# EAGLE design RPiAutonomousCar (EAGLE 7.5.0)
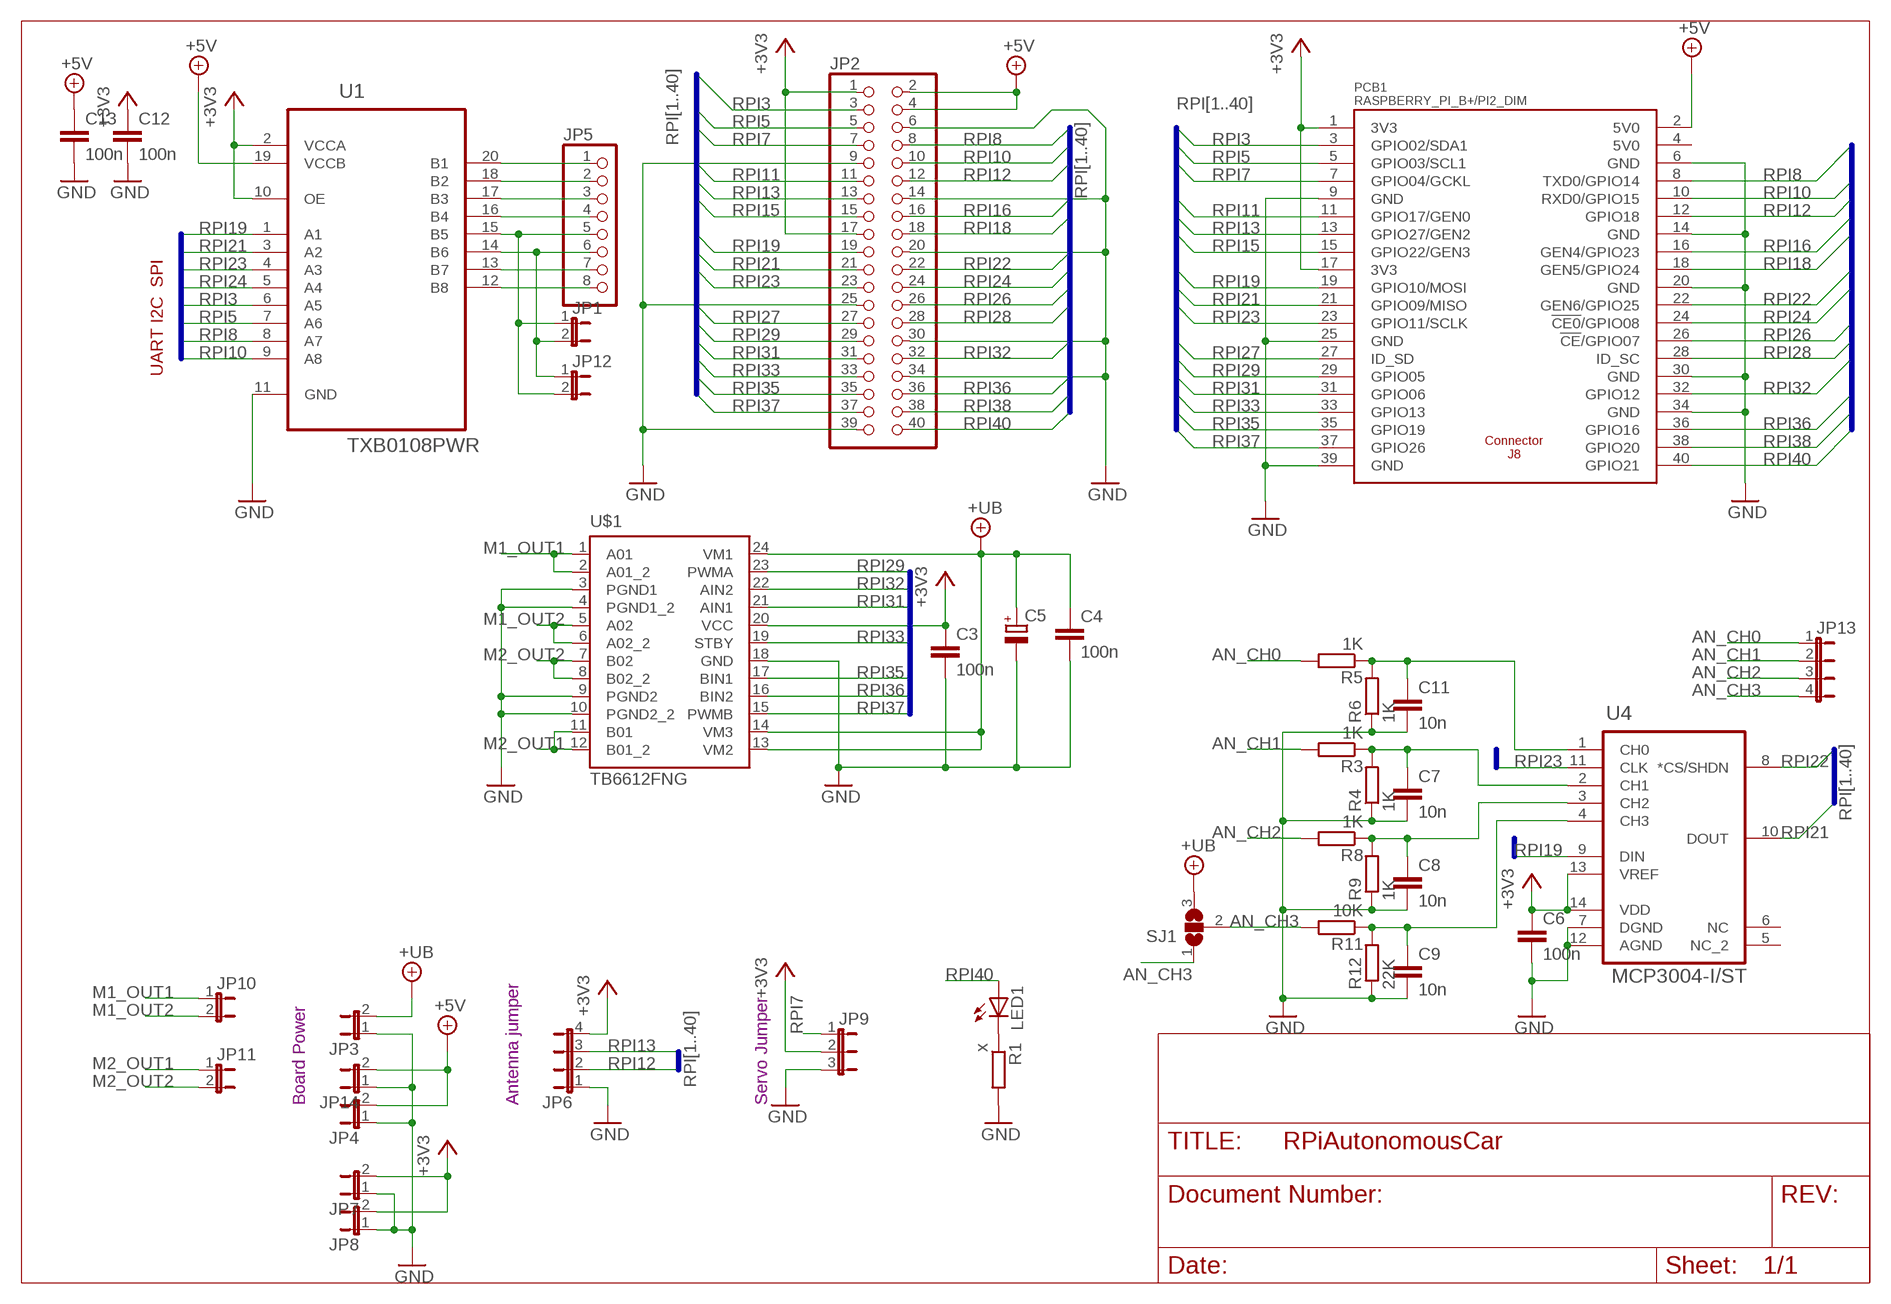
[diagram p0: schematic, sheet 1]

## Parts
C3  100n  C-EUC0603  [C0603]
C4  100n  C-EUC0603  [C0603]
C5  CPOL-EU153CLV-0405  [153CLV-0405]
C6  100n  C-EUC0603  [C0603]
C7  10n  C-EUC0603  [C0603]
C8  10n  C-EUC0603  [C0603]
C9  10n  C-EUC0603  [C0603]
C11  10n  C-EUC0603  [C0603]
C12  100n  C-EUC0603  [C0603]
C13  100n  C-EUC0603  [C0603]
JP1  JP1E  [JP1]
JP2  PINHD-2X20  [2X20]
JP3  JP1E  [JP1]
JP4  JP1E  [JP1]
JP5  PINHD-1X8  [1X08]
JP6  JP4E  [JP4]
JP7  JP1E  [JP1]
JP8  JP1E  [JP1]
JP9  JP2E  [JP2]
JP10  JP1E  [JP1]
JP11  JP1E  [JP1]
JP12  JP1E  [JP1]
JP13  JP4E  [JP4]
JP14  JP1E  [JP1]
LED1  LEDSML0603  [SML0603]
PCB1  RASPBERRY_PI_B+/PI2_DIM  [RASPBERRY_PI_BPLUS_HEADER_ONLY]
R1  x  R-EU_R0603  [R0603]
R3  1K  R-EU_R0603  [R0603]
R4  1K  R-EU_R0603  [R0603]
R5  1K  R-EU_R0603  [R0603]
R6  1K  R-EU_R0603  [R0603]
R8  1K  R-EU_R0603  [R0603]
R9  1K  R-EU_R0603  [R0603]
R11  10K  R-EU_R0603  [R0603]
R12  22K  R-EU_R0603  [R0603]
SJ1  SJ2W  [SJ_2]
U1  TXB0108PWR  [SOP65P640X120-20N]
U4  MCP3004-I/ST  [SOP65P640X120-14N]
U$1  TB6612FNG  [SSOP24]

## Nets
+3V3: C3.1 C6.1 C12.1 JP2.1 JP2.17 JP6.4 JP7.2 JP8.2 JP9.2 PCB1.1(3V3) PCB1.17(3V3) U1.2(VCCA) U1.10(OE) U4.13(VREF) U4.14(VDD) U$1.20(VCC)
+5V: C13.1 JP2.2 JP2.4 JP4.2 JP14.2 PCB1.2(5V0) U1.19(VCCB)
+UB: C4.1 C5.+ JP3.2 SJ1.3 U$1.13(VM2) U$1.14(VM3) U$1.24(VM1)
AN_CH0: JP13.1 R5.2
AN_CH1: JP13.2 R3.2
AN_CH2: JP13.3 R8.2
AN_CH3: JP13.4 R11.2 SJ1.1 SJ1.2
GND: C3.2 C4.2 C5.- C6.2 C7.2 C8.2 C9.2 C11.2 C12.2 C13.2 JP2.6 JP2.9 JP2.14 JP2.20 JP2.25 JP2.30 JP2.34 JP2.39 JP3.1 JP4.1 JP6.1 JP7.1 JP8.1 JP9.3 JP14.1 PCB1.6(GND) PCB1.9(GND) PCB1.14(GND) PCB1.20(GND) PCB1.25(GND) PCB1.30(GND) PCB1.34(GND) PCB1.39(GND) R1.2 R4.1 R6.1 R9.1 R12.1 U1.11(GND) U4.7(DGND) U4.12(AGND) U$1.3(PGND1) U$1.4(PGND1_2) U$1.9(PGND2) U$1.10(PGND2_2) U$1.18(GND)
M1_OUT1: JP10.1 U$1.1(A01) U$1.2(A01_2)
M1_OUT2: JP10.2 U$1.5(A02) U$1.6(A02_2)
M2_OUT1: JP11.1 U$1.11(B01) U$1.12(B01_2)
M2_OUT2: JP11.2 U$1.7(B02) U$1.8(B02_2)
N$1: JP5.8 U1.12(B8)
N$2: JP5.7 U1.13(B7)
N$4: JP1.2 JP5.6 JP12.1 U1.14(B6)
N$5: JP5.4 U1.16(B4)
N$6: JP5.3 U1.17(B3)
N$7: JP5.2 U1.18(B2)
N$8: JP5.1 U1.20(B1)
N$11: C11.1 R5.1 R6.2 U4.1(CH0)
N$12: LED1.C R1.1
N$13: C7.1 R3.1 R4.2 U4.2(CH1)
N$14: C8.1 R8.1 R9.2 U4.3(CH2)
N$15: C9.1 R11.1 R12.2 U4.4(CH3)
N$18: JP1.1 JP5.5 JP12.2 U1.15(B5)
RPI3: JP2.3 PCB1.3(GPIO02/SDA1) U1.6(A5)
RPI5: JP2.5 PCB1.5(GPIO03/SCL1) U1.7(A6)
RPI7: JP2.7 JP9.1 PCB1.7(GPIO04/GCKL)
RPI8: JP2.8 PCB1.8(TXD0/GPIO14) U1.8(A7)
RPI10: JP2.10 PCB1.10(RXD0/GPIO15) U1.9(A8)
RPI11: JP2.11 PCB1.11(GPIO17/GEN0)
RPI12: JP2.12 JP6.2 PCB1.12(GPIO18)
RPI13: JP2.13 JP6.3 PCB1.13(GPIO27/GEN2)
RPI15: JP2.15 PCB1.15(GPIO22/GEN3)
RPI16: JP2.16 PCB1.16(GEN4/GPIO23)
RPI18: JP2.18 PCB1.18(GEN5/GPIO24)
RPI19: JP2.19 PCB1.19(GPIO10/MOSI) U1.1(A1) U4.9(DIN)
RPI21: JP2.21 PCB1.21(GPIO09/MISO) U1.3(A2) U4.10(DOUT)
RPI22: JP2.22 PCB1.22(GEN6/GPIO25) U4.8(*CS/SHDN)
RPI23: JP2.23 PCB1.23(GPIO11/SCLK) U1.4(A3) U4.11(CLK)
RPI24: JP2.24 PCB1.24(!CE0!/GPIO08) U1.5(A4)
RPI26: JP2.26 PCB1.26(!CE!/GPIO07)
RPI27: JP2.27 PCB1.27(ID_SD)
RPI28: JP2.28 PCB1.28(ID_SC)
RPI29: JP2.29 PCB1.29(GPIO05) U$1.23(PWMA)
RPI31: JP2.31 PCB1.31(GPIO06) U$1.21(AIN1)
RPI32: JP2.32 PCB1.32(GPIO12) U$1.22(AIN2)
RPI33: JP2.33 PCB1.33(GPIO13) U$1.19(STBY)
RPI35: JP2.35 PCB1.35(GPIO19) U$1.17(BIN1)
RPI36: JP2.36 PCB1.36(GPIO16) U$1.16(BIN2)
RPI37: JP2.37 PCB1.37(GPIO26) U$1.15(PWMB)
RPI38: JP2.38 PCB1.38(GPIO20)
RPI40: JP2.40 LED1.A PCB1.40(GPIO21)
Unconnected: U4.5(NC_2) U4.6(NC)

## Buses
RPI[1..40]

## Notes on the sheet
- SPI
- I2C
- UART
- Board Power | Antenna jumper | Servo Jumper

## Power pins joined to a net without a drawn wire
5V0: PCB1.4(5V0)

## Library data of the parts
C3 C4 C6-C9 C11-C13 = rcl:C-EU: CAPACITOR, European symbol
C5 = rcl:CPOL-EU: POLARIZED CAPACITOR, European symbol
JP1 JP3 JP4 JP7 JP8 JP10-JP12 JP14 = jumper:JP1E: JUMPER
JP2 = pinhead:PINHD-2X20: PIN HEADER
JP5 = pinhead:PINHD-1X8: PIN HEADER
JP6 JP13 = jumper:JP4E: JUMPER
JP9 = jumper:JP2E: JUMPER
LED1 = led:LED: LED OSRAM: - CHIPLED LG R971, LG N971, LY N971, LG Q971, LY Q971, LO R971, LY R971 LH N974, LH R974 LS Q976, LO Q976, LY Q976 LO Q996 - Hyper CHIPLED LW Q18S LB Q993, LB Q99A, LB R99A - SideLED LS A670, LO A670, LY A670, LG A670, LP A670 LB A673, LV A673, LT A673, LW A673 LH A674 LY A675 LS A676, LA A676, LO A676, LY A676, LW A676 LS A679, LY A679, LG A679 - Hyper Micro SIDELED® LS Y876, LA Y876, LO Y876, LY Y876 LT Y87S - SmartLED LW L88C, LW L88S LB L89C, LB L89S, LG L890 LS L89K, LO L89K, LY L89K LS L896, LA L896, LO L896, LY L896 - TOPLED LS T670, LO T670, LY T670, LG T670, LP T670 LSG T670, LSP T670, LSY T670, LOP T670, LYG T670 LG T671, LOG T671, LSG T671 LB T673, LV T673, LT T673, LW T673 LH T674 LS T676, LA T676, LO T676, LY T676, LB T676, LH T676, LSB T676, LW T676 LB T67C, LV T67C, LT T67C, LS T67K, LO T67K, LY T67K, LW E67C LS E67B, LA E67B, LO E67B, LY E67B, LB E67C, LV E67C, LT E67C LW T67C LS T679, LY T679, LG T679 LS T770, LO T770, LY T770, LG T770, LP T770 LB T773, LV T773, LT T773, LW T773 LH T774 LS E675, LA E675, LY E675, LS T675 LS T776, LA T776, LO T776, LY T776, LB T776 LHGB T686 LT T68C, LB T68C - Hyper Mini TOPLED® LB M676 - Mini TOPLED Santana® LG M470 LS M47K, LO M47K, LY M47K Source: http://www.osram.convergy.de LUXEON: - LUMILED® LXK2-PW12-R00, LXK2-PW12-S00, LXK2-PW14-U00, LXK2-PW14-V00 LXK2-PM12-R00, LXK2-PM12-S00, LXK2-PM14-U00 LXK2-PE12-Q00, LXK2-PE12-R00, LXK2-PE12-S00, LXK2-PE14-T00, LXK2-PE14-U00 LXK2-PB12-K00, LXK2-PB12-L00, LXK2-PB12-M00, LXK2-PB14-N00, LXK2-PB14-P00, LXK2-PB14-Q00 LXK2-PR12-L00, LXK2-PR12-M00, LXK2-PR14-Q00, LXK2-PR14-R00 LXK2-PD12-Q00, LXK2-PD12-R00, LXK2-PD12-S00 LXK2-PH12-R00, LXK2-PH12-S00 LXK2-PL12-P00, LXK2-PL12-Q00, LXK2-PL12-R00 Source: www.luxeon.com KINGBRIGHT: KA-3528ASYC Source: www.kingbright.com
PCB1 = RPiAutonomousCar:RASPBERRY_PI_B+/PI2: Raspberry Pi B+ Basedon issue: Thursday, July 10, 2014 - Rev 1.2 LBR by Tim Rettmann 07-2014
R1 R3-R6 R8 R9 R11 R12 = rcl:R-EU_: RESISTOR, European symbol
SJ1 = jumper:SJ2W: SMD solder JUMPER
U1 = RPiAutonomousCar:TXB0108PWR: 8-BIT BIDIRECTIONAL VOLTAGE-LEVEL TRANSLATOR; MPN: TXB0108PWR; OC_FARNELL: 1494945; OC_NEWARK: 27M1151; PACKAGE: TSSOP-20; SUPPLIER: Texas Instruments
U4 = RPiAutonomousCar:MCP3004-I/ST: IC, 10BIT ADC 4-CH, SMD; MPN: MCP3004-I/ST; OC_FARNELL: 1523365; OC_NEWARK: 74M3032; PACKAGE: 14TSSOP; SUPPLIER: Microchip
U$1 = RPiAutonomousCar:TB6612FNG

## Net classes
1 vcc: width 0.203 mm

## Board
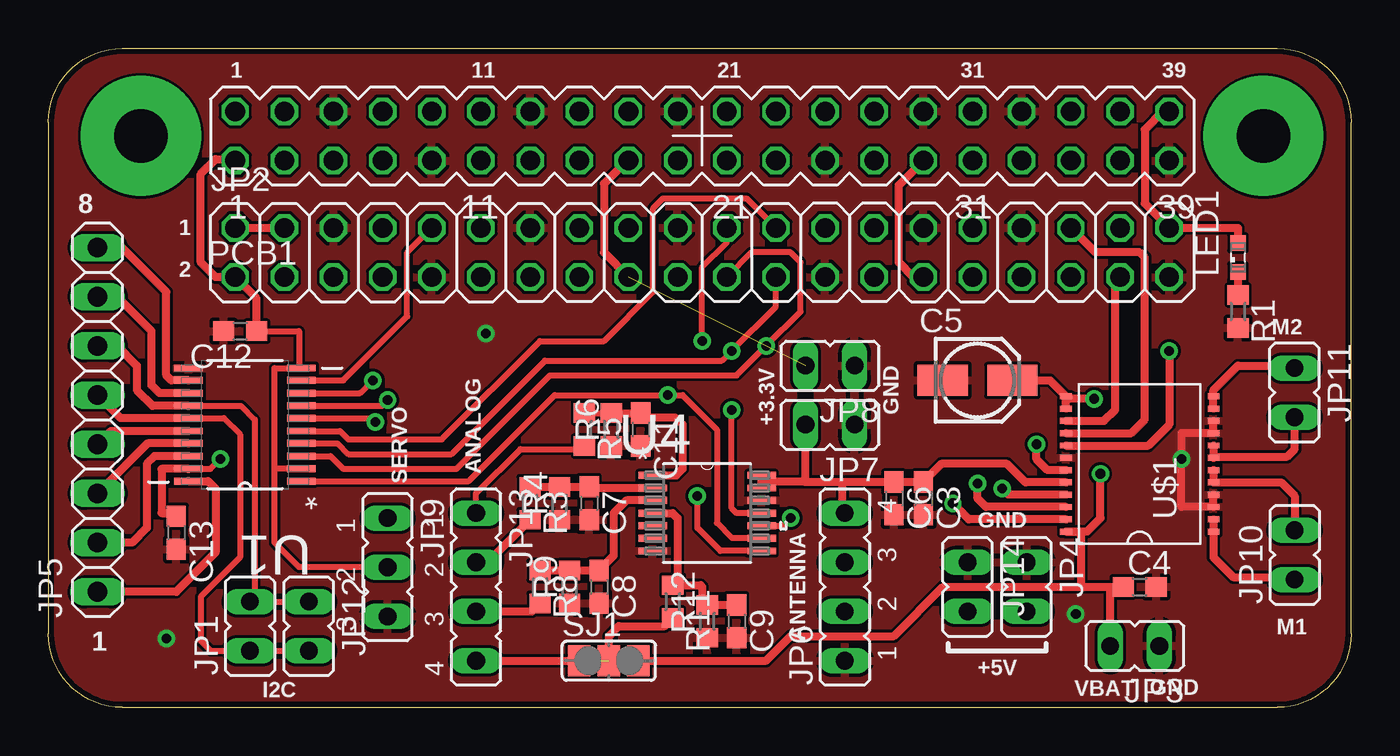
[diagram p1: board, top side]
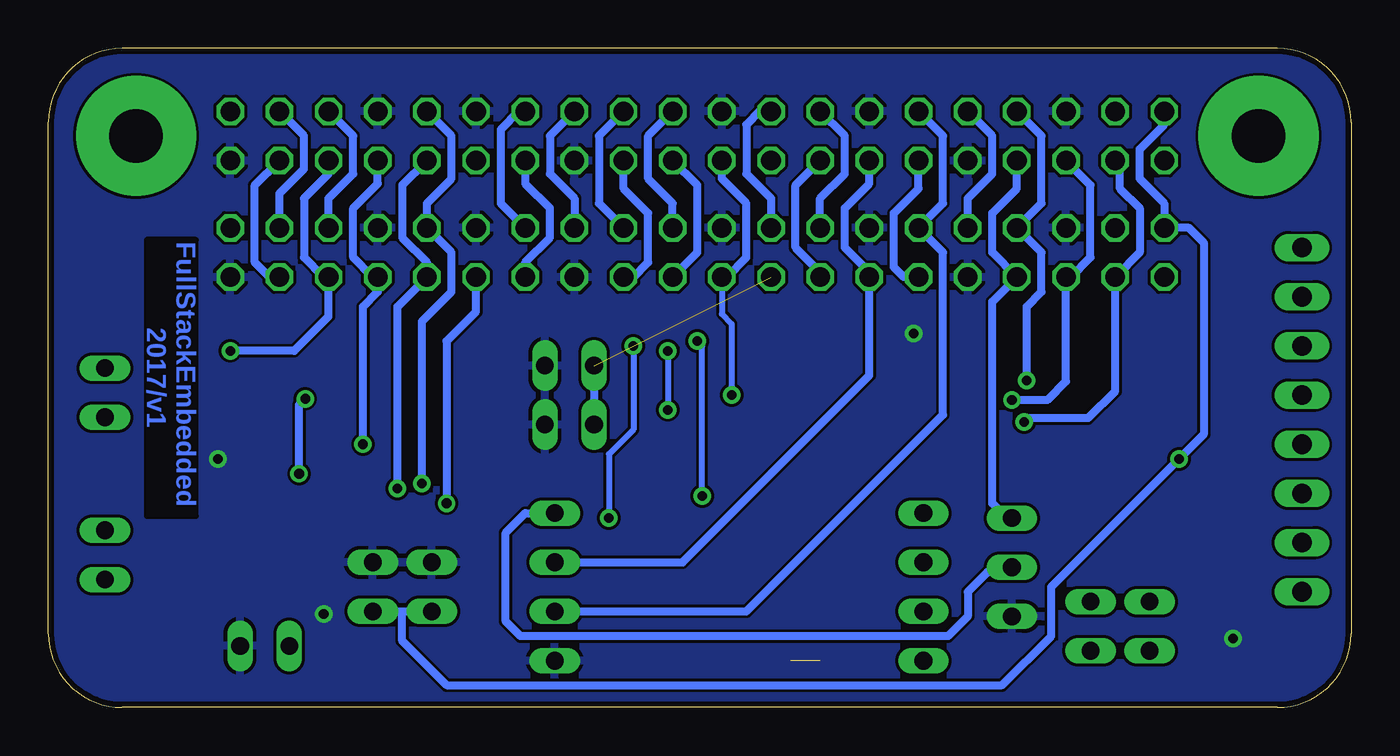
[diagram p2: board, bottom side, seen from below]

Size 67.31 x 34.04 mm. Coordinates in mm from the lower left corner, seen from the top.
Outline: 67.31,3.81 arc-90 63.5,0 3.81,0 arc-90 0,3.81 0,30.23 arc-90 3.81,34.04 63.5,34.04 arc-90 67.31,30.23 67.31,3.81
Copper layers (1*16): Top 0.035mm / dielectric 1.5mm / Bottom 0.035mm
Design rules "PCB-POOL Standard": minimum track width 0.15mm, minimum drill 0.3mm, track to track 0.15mm, track to pad 0.15mm, pad to pad 0.15mm, via to via 0.15mm, smd to smd 0.15mm, copper to edge 0.3mm, drill to drill 0.2mm, minimum pad ring 0.2mm, minimum via ring 0.15mm, stop-mask expansion 0.075mm, vias tented up to drill 0mil, thermal gap 0.2mm

### Footprints (pad centres in the part's own frame; a part is rotated, then mirrored left to right if it is on the bottom)
C0603 = smd 1.1 x 1: 1 -0.85,0; 2 0.85,0
153CLV-0405 = smd 2.6 x 1.6: + 1.8,0; - -1.8,0
JP1 = drill 0.914 long: 1 0,-1.27; 2 0,1.27
2X20 = drill 1.016 octagon: 1 -24.13,-1.27; 2 -24.13,1.27; 3 -21.59,-1.27; 4 -21.59,1.27; 5 -19.05,-1.27; 6 -19.05,1.27; 7 -16.51,-1.27; 8 -16.51,1.27; 9 -13.97,-1.27; 10 -13.97,1.27; 11 -11.43,-1.27; 12 -11.43,1.27; 13 -8.89,-1.27; 14 -8.89,1.27; 15 -6.35,-1.27; 16 -6.35,1.27; 17 -3.81,-1.27; 18 -3.81,1.27; 19 -1.27,-1.27; 20 -1.27,1.27; 21 1.27,-1.27; 22 1.27,1.27; 23 3.81,-1.27; 24 3.81,1.27; 25 6.35,-1.27; 26 6.35,1.27; 27 8.89,-1.27; 28 8.89,1.27; 29 11.43,-1.27; 30 11.43,1.27; 31 13.97,-1.27; 32 13.97,1.27; 33 16.51,-1.27; 34 16.51,1.27; 35 19.05,-1.27; 36 19.05,1.27; 37 21.59,-1.27; 38 21.59,1.27; 39 24.13,-1.27; 40 24.13,1.27
1X08 = drill 1.016 long: 1 -8.89,0; 2 -6.35,0; 3 -3.81,0; 4 -1.27,0; 5 1.27,0; 6 3.81,0; 7 6.35,0; 8 8.89,0
JP4 = drill 0.914 long: 1 -3.81,0; 2 -1.27,0; 3 1.27,0; 4 3.81,0
JP2 = drill 0.914 long: 1 -2.54,0; 2 0,0; 3 2.54,0
SML0603 = smd 0.8 x 0.8: A 0.75,0; C -0.75,0
RASPBERRY_PI_BPLUS_HEADER_ONLY = drill 1.016 octagon: 1 -22.11,8.05; 2 -22.11,10.59; 3 -19.57,8.05; 4 -19.57,10.59; 5 -17.03,8.05; 6 -17.03,10.59; 7 -14.49,8.05; 8 -14.49,10.59; 9 -11.95,8.05; 10 -11.95,10.59; 11 -9.41,8.05; 12 -9.41,10.59; 13 -6.87,8.05; 14 -6.87,10.59; 15 -4.33,8.05; 16 -4.33,10.59; 17 -1.79,8.05; 18 -1.79,10.59; 19 0.75,8.05; 20 0.75,10.59; 21 3.29,8.05; 22 3.29,10.59; 23 5.83,8.05; 24 5.83,10.59; 25 8.37,8.05; 26 8.37,10.59; 27 10.91,8.05; 28 10.91,10.59; 29 13.45,8.05; 30 13.45,10.59; 31 15.99,8.05; 32 15.99,10.59; 33 18.53,8.05; 34 18.53,10.59; 35 21.07,8.05; 36 21.07,10.59; 37 23.61,8.05; 38 23.61,10.59; 39 26.15,8.05; 40 26.15,10.59 | drill 2.75 pad 6.2: PE_TL -26.98,9.32; PE_TR 31.02,9.32
R0603 = smd 1 x 1.1: 1 -0.85,0; 2 0.85,0
SJ_2 = smd 1.168 x 1.6: 1 -1.524,0; 2 0,0; 3 1.524,0
SOP65P640X120-20N = smd 1.473 x 0.356: 1 -2.921,2.921; 2 -2.921,2.286; 3 -2.921,1.626; 4 -2.921,0.965; 5 -2.921,0.33; 6 -2.921,-0.33; 7 -2.921,-0.965; 8 -2.921,-1.626; 9 -2.921,-2.286; 10 -2.921,-2.921; 11 2.921,-2.921; 12 2.921,-2.286; 13 2.921,-1.626; 14 2.921,-0.965; 15 2.921,-0.33; 16 2.921,0.33; 17 2.921,0.965; 18 2.921,1.626; 19 2.921,2.286; 20 2.921,2.921
SOP65P640X120-14N = smd 1.473 x 0.356: 1 -2.819,1.956; 2 -2.819,1.295; 3 -2.819,0.66; 4 -2.819,0; 5 -2.819,-0.66; 6 -2.819,-1.295; 7 -2.819,-1.956; 8 2.819,-1.956; 9 2.819,-1.295; 10 2.819,-0.66; 11 2.819,0; 12 2.819,0.66; 13 2.819,1.295; 14 2.819,1.956
SSOP24 = smd 0.305 x 0.61: 1 -3.493,-3.81; 2 -2.857,-3.81; 3 -2.223,-3.81; 4 -1.587,-3.81; 5 -0.953,-3.81; 6 -0.318,-3.81; 7 0.318,-3.81; 8 0.953,-3.81; 9 1.587,-3.81; 10 2.223,-3.81; 11 2.857,-3.81; 12 3.493,-3.81; 13 3.493,3.81; 14 2.857,3.81; 15 2.223,3.81; 16 1.587,3.81; 17 0.953,3.81; 18 0.318,3.81; 19 -0.318,3.81; 20 -0.953,3.81; 21 -1.587,3.81; 22 -2.223,3.81; 23 -2.857,3.81; 24 -3.493,3.81

### Placement (x,y rotation side)
C3  45.21,10.79 270 top
C4  56.39,6.22 0 top
C5  48.01,16.89 0 top
C6  43.69,10.79 270 top
C7  27.94,10.54 270 top
C8  28.45,6.22 270 top
C9  35.56,4.44 270 top
C11  30.61,14.35 270 top
C12  9.91,19.43 180 top
C13  6.6,9.02 270 top
JP1  10.41,4.19 0 top
JP2  33.78,23.49 0 top
JP3  56.13,3.17 90 top
JP4  50.55,6.22 180 top
JP5  2.54,14.86 90 top
JP6  41.15,6.22 90 top
JP7  40.39,14.61 90 top
JP8  40.39,17.65 90 top
JP9  17.53,7.24 270 top
JP10  64.39,7.87 0 top
JP11  64.39,16.26 180 top
JP12  13.46,4.19 180 top
JP13  22.1,6.22 270 top
JP14  47.5,6.22 180 top
LED1  61.47,23.24 90 top
PCB1  31.76,20.19 0 top
R1  61.47,20.45 270 top
R3  24.89,10.54 270 top
R4  26.42,10.54 90 top
R5  27.69,14.35 270 top
R6  29.08,14.35 90 top
R8  25.4,6.22 270 top
R9  26.92,6.22 90 top
R11  32.26,5.46 270 top
R12  34.04,4.44 90 top
SJ1  28.96,2.41 0 top
U1  10.16,14.61 180 top
U4  34.04,10.03 0 top
U$1  56.39,12.57 90 top

### Tracks (layer width: path | path; a pad name or v marks a point on that pad's centre or on a via)
+3V3  (1 unrouted)
  Top 0.305: U1.10 12.66,17.53 | JP9.2 12.95,7.24 11.68,8.51 11.68,12.32 | U1.2 11.68,12.32 | 11.68,12.32 11.68,17.53 U1.10 | C12.1 12.95,19.43 12.95,17.53 U1.10
  Top 0.406: PCB1.17 29.89,28.24 28.7,27.05 28.7,23.49 JP2.17 | C12.1 10.76,21.12 JP2.1 8.64,22.22 7.87,22.99 7.87,27.56 8.64,28.32 9.57,28.32 PCB1.1 | U4.13 U4.14 36.86,11.65 39.12,11.65 | 45.24,11.62 C3.1 | U$1.20 50.48,11.62 49.53,12.57 46.14,12.57 C3.1 | 39.12,11.65 41.02,11.65 | 41.02,11.65 C6.1 C3.1 | 39.12,11.65 JP7.2 | JP6.4 41.02,10.03 41.02,11.65
  Bottom 0.406: 17.53,6.98 18.8,6.98 19.81,5.97 19.81,4.7 20.83,3.68 42.93,3.68 43.69,4.44 43.69,9.02 42.67,10.03 JP6.4 | 17.27,6.98 17.53,6.98 | 17.53,6.98 JP9.2 | JP8.2 JP7.2
+5V  (via drill 0.5)
  Top 0.305: U1.19 8.38,12.32 v8.89,12.83
  Top 0.406: JP2.2 JP2.4 | U1.19 5.84,12.32 5.84,10.03 6.6,10.03 C13.1
  Bottom 0.406: PCB1.2 9.65,30.1 10.92,28.83 10.92,27.3 9.65,26.04 JP2.2 8.38,24.77 7.62,24 7.62,14.1 v8.89,12.83 15.49,6.22 15.49,3.68 18.03,1.14 46.74,1.14 49.02,3.43 49.02,4.95 | JP4.2 49.02,4.95 | 49.02,4.95 JP14.2
+UB  (via drill 0.5)
  Top 0.406: SJ1.3 37.08,2.41 38.35,3.68 43.69,3.68 46.23,6.22 53.34,6.22 | U$1.14 U$1.13 | v54.36,12.07 54.36,9.78 53.66,9.08 U$1.24 53.34,9.08 53.34,6.22 | v54.04,15.94 52.71,15.94 U$1.13 | 53.34,6.22 54.86,6.22 | 54.86,6.22 C4.1 | JP3.2 54.86,6.22 | C5.+ 51.75,16.89 U$1.13
  Bottom 0.406: v54.36,12.07 54.36,15.62 v54.04,15.94
AN_CH0
  Top 0.305: JP13.1 22.1,11.05 24.38,13.34 27.6,13.34 R5.2
AN_CH1
  Top 0.406: JP13.2 22.69,7.49 R3.2
AN_CH2
  Top 0.305: 24.98,4.95 R8.2
  Top 0.406: JP13.3 24.98,4.95
AN_CH3  (1 unrouted)
  Top 0.406: JP13.4 SJ1.1 | SJ1.2 28.96,3.68 29.46,4.19 31.84,4.19 R11.2
GND  (via drill 0.5)
  Top 0.406: U$1.10 U$1.9 58.55,14.16 v58.55,12.83 58.55,10.35 U$1.3 U$1.4
  other vias: 22.61,19.3 53.09,4.83 6.1,3.56
  pour Bottom: 0.25,34.16 67.31,34.16 67.31,0.13 0.25,0.13
  pour Top: 0.25,34.16 67.31,34.16 67.31,0.13 0.25,0.13
M1_OUT1
  Top 0.406: U$1.2 U$1.1 60.2,7.75 61.21,6.73 64.26,6.73 JP10.1
M1_OUT2
  Top 0.406: U$1.6 U$1.5 63.69,11.62 64.39,10.92 JP10.2
M2_OUT1
  Top 0.406: U$1.12 U$1.11 60.2,16.38 61.47,17.65 64.26,17.65 JP11.1
M2_OUT2
  Top 0.406: 60.2,12.95 U$1.7 | U$1.8 60.2,12.95 | 60.2,12.95 64.01,12.95 64.39,13.34 JP11.2
N$1
  Top 0.406: JP5.8 3.81,23.75 6.1,21.46 6.1,17.14 6.35,16.89 U1.12
N$2
  Top 0.406: U1.13 5.74,16.23 5.33,16.64 5.33,19.43 3.56,21.21 JP5.7
N$4
  Top 0.305: U1.14 9.96,15.57 10.67,14.86 10.67,5.71 JP1.2 JP12.1
  Top 0.406: U1.14 5.38,15.57 4.57,16.38 4.57,17.65 3.56,18.67 JP5.6
N$5
  Top 0.406: U1.16 3.23,14.28 JP5.4
N$6
  Top 0.406: U1.17 5.13,13.64 JP5.3
N$7
  Top 0.406: U1.18 5.49,12.98 5.08,12.57 5.08,9.27 4.32,8.51 JP5.2
N$8
  Top 0.406: U1.20 8.26,11.68 8.64,11.3 8.64,8 6.6,5.97 JP5.1
N$11
  Top 0.305: R5.1 R6.2
  Top 0.406: R6.2 C11.1 30.86,14.95 32.42,14.95 32.77,14.61 32.77,12.32 32.44,11.99 U4.1
N$12
  Top 0.406: LED1.C R1.1
N$13
  Top 0.406: R3.1 R4.2 C7.1 27.94,11.33 U4.2
N$14
  Top 0.406: R8.1 R9.2 C8.1 29.21,7.83 29.21,10.03 29.87,10.69 U4.3
N$15
  Top 0.305: 33.78,5.55 R12.2 | 33.69,6.31 33.78,6.22
  Top 0.406: 33.78,6.22 33.78,5.55 | R12.2 C9.1 | 33.69,6.31 R11.1 32.51,6.56 32.51,9.78 32.26,10.03 U4.4
N$18
  Top 0.305: JP12.2 JP1.1 8.38,2.92 7.87,3.43 7.87,5.71 9.91,7.75 9.91,14.1 9.07,14.94 U1.15
  Top 0.406: U1.15 3.73,14.94 JP5.5
RPI3  (via drill 0.5)
  Top 0.305: U1.6 16.69,14.94 v16.89,14.73
  Bottom 0.406: PCB1.3 11.94,27.99 11.94,26.8 10.92,25.78 10.92,23.49 JP2.3 12.19,16.33 13.59,14.94 16.69,14.94 v16.89,14.73
RPI5  (via drill 0.5)
  Top 0.305: U1.7 17.22,15.57 v17.53,15.88
  Bottom 0.406: PCB1.5 13.46,26.97 13.46,23.24 14.48,22.22 JP2.5 14.73,16.84 15.7,15.88 v17.53,15.88
RPI7
  Bottom 0.305: 17.53,21.97 JP2.7
  Bottom 0.406: PCB1.7 17.27,26.8 18.54,25.53 18.54,23.49 JP2.7 18.54,20.95 18.54,10.54 17.78,9.78 JP9.1
RPI8  (via drill 0.5)
  Top 0.305: U1.8 16.1,16.23 v16.76,16.89
  Bottom 0.406: PCB1.8 16,29.51 16,26.04 JP2.8 16,23.49 16,21.46 16.76,20.7 v16.76,16.89
RPI10
  Top 0.305: U1.9 15.24,16.89 18.54,20.19 18.54,23.49 JP2.10
  Bottom 0.406: JP2.10 19.81,26.29 18.54,27.56 18.54,29.51 PCB1.10
RPI11
  Bottom 0.406: JP2.11 23.11,22.22 23.62,22.73 23.62,25.53 22.35,26.8 PCB1.11
RPI12
  Bottom 0.406: PCB1.12 21.08,29.51 21.08,26.04 JP2.12 21.08,23.49 21.08,15.11 31.24,4.95 JP6.2
RPI13
  Bottom 0.406: PCB1.13 24.89,27.05 26.16,25.78 26.16,23.75 24.89,22.48 JP2.13 24.89,17.14 34.54,7.49 JP6.3
RPI15
  Bottom 0.406: PCB1.15 28.7,26.97 28.7,23.75 27.43,22.48 JP2.15
RPI16
  Bottom 0.406: JP2.16 27.43,26.29 26.16,27.56 26.16,29.51 PCB1.16
RPI18
  Bottom 0.406: PCB1.18 30.56,30.78 31.24,30.1 31.24,27.56 29.97,26.29 JP2.18
RPI19  (via drill 0.5)
  Top 0.305: U1.1 21.72,11.68 26.16,16.13 v32,16.13 32.77,16.13 34.54,14.35 34.54,9.53 35.33,8.74 U4.9
  Bottom 0.305: JP2.19 32.51,20.32 32,19.81 v32,16.13
  Bottom 0.406: JP2.19 32.26,22.22 31.24,23.24 31.24,26.04 32.51,27.3 PCB1.19
RPI21  (via drill 0.5)
  Top 0.305: U1.3 14.58,12.98 15.24,12.32 21.08,12.32 25.91,17.14 35.56,17.14 v37.08,18.67 38.86,20.45 38.86,22.99 38.35,23.49 36.32,23.49 JP2.21 | U4.10 37.95,9.37 v38.35,9.78
  Bottom 0.305: v37.08,18.67 37.08,14.35 38.35,13.08 v38.35,9.78
  Bottom 0.406: JP2.21 33.78,23.49 33.78,26.97 PCB1.21
RPI22  (via drill 0.5)
  Top 0.305: U4.8 34.72,8.08 33.53,9.27 v33.53,10.92 | v33.78,18.92 33.78,22.73 35.05,24 JP2.22
  Bottom 0.305: v33.53,10.92 33.53,18.67 v33.78,18.92
  Bottom 0.406: JP2.22 35.05,26.04 36.32,27.3 36.32,29.51 PCB1.22
RPI23  (via drill 0.5)
  Top 0.305: U1.4 14.94,13.64 15.49,13.08 20.83,13.08 25.65,17.91 34.8,17.91 v35.31,18.41 37.59,20.7 JP2.23 | U4.11 35.56,10.03 35.31,10.29 v35.31,15.37
  Bottom 0.305: v35.31,18.41 v35.31,15.37
  Bottom 0.406: JP2.23 37.08,22.22 36.32,22.99 36.32,25.53 37.59,26.8 PCB1.23
RPI24
  Top 0.305: U1.5 15.06,14.28 15.49,13.84 20.32,13.84 25.4,18.92 28.7,18.92 31.24,21.46 31.24,25.78 31.75,26.29 36.07,26.29 JP2.24
  Bottom 0.406: PCB1.24 38.86,29.51 38.86,26.04 JP2.24
RPI26
  Bottom 0.406: PCB1.26 41.4,29.51 41.4,27.56 40.13,26.29 JP2.26
RPI27
  Bottom 0.406: PCB1.27 42.67,27.05 41.4,25.78 41.4,24.26 42.67,22.99 JP2.27
RPI28
  Bottom 0.406: PCB1.28 43,30.78 43.94,29.84 43.94,26.04 JP2.28
RPI29  (via drill 0.5)
  Top 0.406: JP2.29 44.7,22.22 43.94,22.99 43.94,26.97 PCB1.29 | U$1.23 47.56,9.71 v46.74,10.54
  Bottom 0.406: JP2.29 45.21,20.45 46.74,18.92 v46.74,10.54
RPI31  (via drill 0.5)
  Top 0.406: U$1.21 49.59,10.99 v49.28,11.3
  Bottom 0.406: PCB1.31 49.02,26.97 49.02,24.26 47.75,22.99 JP2.31 49.28,20.7 v49.28,11.3
RPI32  (via drill 0.5)
  Top 0.406: U$1.22 48.45,10.35 48.01,10.79 v48.01,11.56
  Bottom 0.406: PCB1.32 46.48,29.51 46.48,27.3 47.75,26.04 JP2.32 46.48,23.49 46.48,21.46 48.01,19.94 v48.01,11.56
RPI33  (via drill 0.5)
  Top 0.406: U$1.19 51.63,12.26 51.05,12.83 v51.05,13.59
  Bottom 0.406: PCB1.33 50.29,27.05 51.56,25.78 51.56,23.24 50.55,22.22 JP2.33 50.29,21.46 51.05,20.7 v51.05,13.59
RPI35  (via drill 0.5)
  Top 0.406: v57.91,18.41 57.91,14.61 56.83,13.53 U$1.17
  Bottom 0.406: PCB1.35 52.83,27.56 54.1,26.29 54.1,23.24 53.09,22.22 JP2.35 52.83,20.19 54.61,18.41 v57.91,18.41
RPI36
  Top 0.406: U$1.16 55.94,14.16 56.64,14.86 56.64,23.24 56.39,23.49 54.1,23.49 JP2.36
  Bottom 0.406: JP2.36 52.83,26.29 51.56,27.56 51.56,29.51 PCB1.36
RPI37
  Top 0.406: U$1.15 54.55,14.79 55.12,15.37 55.12,21.97 JP2.37
  Bottom 0.406: JP2.37 55.88,22.22 56.64,22.99 56.64,26.97 PCB1.37
RPI38
  Bottom 0.406: JP2.38 55.37,26.54 54.1,27.81 54.1,29.51 PCB1.38
RPI40
  Top 0.406: PCB1.40 57.58,30.78 56.64,29.84 56.64,26.04 JP2.40 61.47,24.77 LED1.A

### Text on the board
Bottom: FullStackEmbedded / 2017/v1
tPlace: 1 | 11 | 21 | 31 | 39 | 8 | 1 | 2 | M2 | +3.3V | GND | ANALOG | SERVO | GND | 1 | M1 | ANTENNA | +5V | VBAT | GND | I2C